# Altium schematic sheet flarm-f4-interface.SchDoc
size A4; SheetNumber: 1; SheetTotal: 1
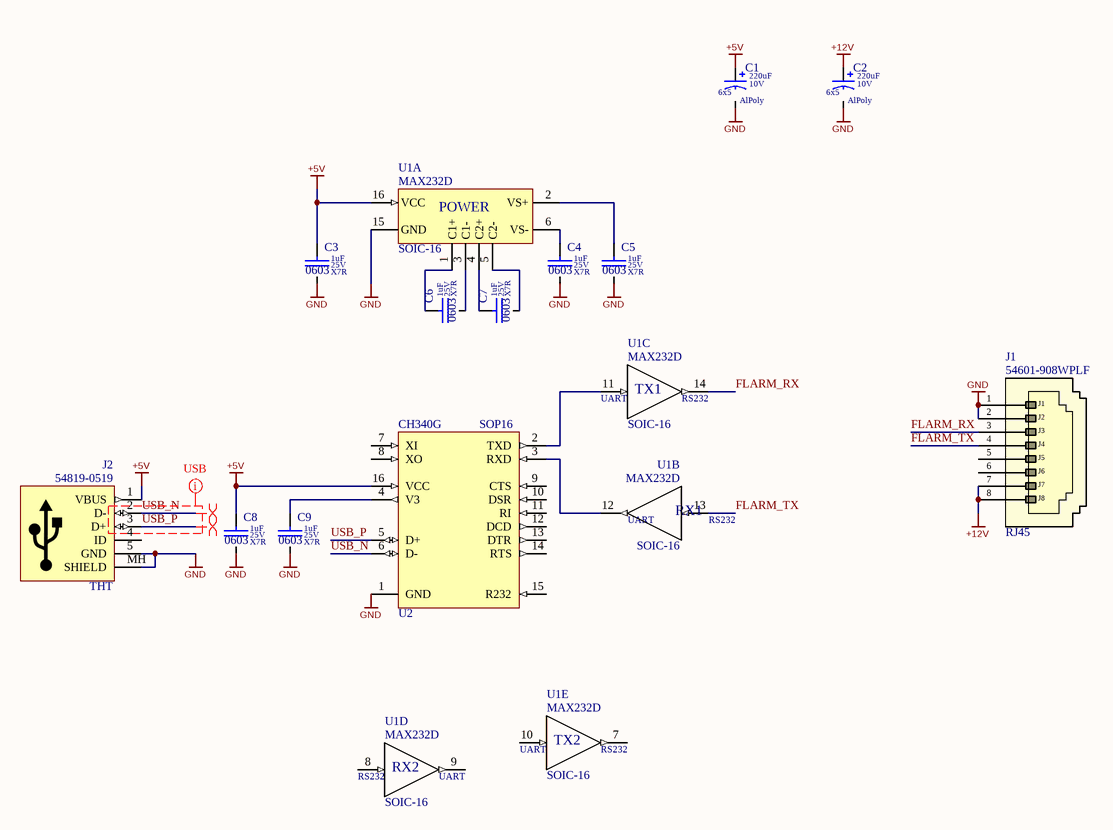
[diagram p0: flarm-f4-interface.SchDoc]

## Parts
C1  value 220uF  Dielectric: AlPoly  SCH_Footprint: 6x5  Voltage: 10V  [CE_D_6x5_SMD]  (hidden comment: Electrolytic Capacitor)
C2  value 220uF  Dielectric: AlPoly  SCH_Footprint: 6x5  Voltage: 10V  [CE_D_6x5_SMD]  (hidden comment: Electrolytic Capacitor)
C3  value 1uF  Dielectric: X7R  Voltage: 25V  SCH_Footprint: 0603  [C_0603_1608]  (hidden comment: Ceramic X7R)
C4  value 1uF  Dielectric: X7R  Voltage: 25V  SCH_Footprint: 0603  [C_0603_1608]  (hidden comment: Ceramic X7R)
C5  value 1uF  Dielectric: X7R  Voltage: 25V  SCH_Footprint: 0603  [C_0603_1608]  (hidden comment: Ceramic X7R)
C6  value 1uF  Dielectric: X7R  Voltage: 25V  SCH_Footprint: 0603  [C_0603_1608]  (hidden comment: Ceramic X7R)
C7  value 1uF  Dielectric: X7R  Voltage: 25V  SCH_Footprint: 0603  [C_0603_1608]  (hidden comment: Ceramic X7R)
C8  value 1uF  Dielectric: X7R  Voltage: 25V  SCH_Footprint: 0603  [C_0603_1608]  (hidden comment: Ceramic X7R)
C9  value 1uF  Dielectric: X7R  Voltage: 25V  SCH_Footprint: 0603  [C_0603_1608]  (hidden comment: Ceramic X7R)
J1  value 54601-908WPLF  SCH_Footprint: RJ45  [J_RJ45_54601-908WPLF]  (hidden comment: RJ45 without magnetics)
J2  value 54819-0519  SCH_Footprint: THT  [J_USB_MINIB_54819-0519_THT]  (hidden comment: USB connector)
U1  value MAX232D  SCH_Footprint: SOIC-16  [SOP16_SO16_SOIC16_4X10X6]  (hidden comment: MAX232D UART/RS-232 Converter)  (parts A,B,C,D,E of 5)
U2  value CH340G  SCH_Footprint: SOP16  [SOP16_SO16_SOIC16_4X10X6]  (hidden comment: USB to serial chip)

## Nets
+5V: C1.1 C3.1 C8.1 J2.1(VBUS) U1.16(VCC) U2.16(VCC)
+12V: C2.1 J1.7 J1.8
GND: C1.2 C2.2 C3.2 C4.2 C5.2 C8.2 C9.2 J1.1 J1.2 J2.5(GND) J2.MH(SHIELD) U1.15(GND) U2.1(GND)
FLARM_RX: J1.3 U1.14(T1OUT)
FLARM_TX: J1.4 U1.13(R1IN)
USB_N: J2.2(D-) U2.6(D-)
USB_P: J2.3(D+) U2.5(D+)
NetC4_1: C4.1 U1.6(VS-)
NetC5_1: C5.1 U1.2(VS+)
NetC6_1: C6.1 U1.1(C1+)
NetC6_2: C6.2 U1.3(C1-)
NetC7_1: C7.1 U1.4(C2+)
NetC7_2: C7.2 U1.5(C2-)
NetC9_1: C9.1 U2.4(V3)
NetU1_11: U1.11(T1IN) U2.2(TXD)
NetU1_12: U1.12(R1OUT) U2.3(RXD)

Not connected (* = marked no-connect by the designer): J1 5 6; J2 4(ID); U1 7(T2OUT) 8(R2IN) 9(R2OUT) 10(T2IN); U2 7(XI) 8(XO) 9(CTS) 10(DSR) 11(RI) 12(DCD) 13(DTR) 14(RTS) 15(R232)

## Layout directives
differential pair: USB_N, USB_P
net class USB: USB_N, USB_P

## Notes on the sheet
- (in symbol J_RJ45_54601-908WPLF) J2; J3; J4; J5; J6; J7; J8
- (in symbol U_MAX232D, part A) POWER
- (in symbol U_MAX232D, part B) RX1; UART; RS232
- (in symbol U_MAX232D, part C) TX1; UART; RS232
- (in symbol U_MAX232D, part D) RX2; RS232; UART
- (in symbol U_MAX232D, part E) TX2; UART; RS232

## Library data of the parts
C1 C2 = CE_220uF_10V_AlPoly_6x5_20: Polarized Capacitor; Manufacturer: Wurth Elektronik; Manufacturer Part Number: 875105244013; Tolerance (%): 20; Part Number: CE_220uF_10V_AlPoly_6x5_20; HelpURL: https://datasheet.octopart.com/875105244013-W%C3%BCrth-Elektronik-datasheet-37144758.pdf; Supplier 1: TME; Supplier 2: RS Components; Supplier Part Number 2: 8387471; Supplier 3: Farnell; Supplier Part Number 3: 2466651; Supplier 4: Mouser; Supplier Part Number 4: 710-875105244013; Supplier 5: Digi-Key; Supplier Part Number 5: 732-6413-1-ND; Supplier 6: LCSC
C3-C9 = C_1uF_25V_X7R_0603_10: Capacitor; Manufacturer: Samsung; Manufacturer Part Number: CL10B105KA8NNNC; Tolerance (%): 10; Part Number: C_1uF_25V_X7R_0603_10; HelpURL: http://www.tme.eu/pl/Document/4a42202b32dab16128fe107dd69598cc/samsung-chip-cap.pdf; Supplier 1: TME; Supplier Part Number 1: CL10B105KA8NNNC; Supplier 2: RS Components; Supplier 3: Farnell; Supplier 4: Mouser; Supplier 5: Digi-Key; Supplier 6: LCSC
J1 = J_RJ45_54601-908WPLF: Manufacturer: Amphenol; Part Number: J_RJ45_54601-908WPLF; HelpURL: https://cdn.amphenol-icc.com/media/wysiwyg/files/drawing/c-bmj-0051.pdf; Manufacturer Part Number: 54601-908WPLF; Supplier 1: TME; Supplier Part Number 1: 54601-908WPLF; Supplier 2: RS Components; Supplier 3: Farnell; Supplier Part Number 3: 2135981; Supplier 4: Mouser; Supplier Part Number 4: 649-54601-908WPLF; Supplier 5: Digi-Key; Supplier Part Number 5: 609-5081-ND; Supplier 6: LCSC
J2 = J_USB_MINIB_54819-0519: USB A THT Connector; Manufacturer: Molex; Part Number: J_USB_MINIB_54819-0519; HelpURL: http://www.molex.com/pdm_docs/sd/548190519_sd.pdf; Manufacturer Part Number: 54819-0519; Supplier 1: TME; Supplier Part Number 1: MX-54819-0519; Supplier 2: RS Components; Supplier Part Number 2: 5152005P; Supplier 3: Farnell; Supplier Part Number 3: 9786465; Supplier 4: Mouser; Supplier Part Number 4: 538-54819-0519; Supplier 5: Digi-Key; Supplier 6: LCSC
U1 = U_MAX232D: Manufacturer: Texas Instruments; Part Number: U_MAX232D; HelpURL: https://www.ti.com/lit/ds/symlink/max232.pdf; Manufacturer Part Number: MAX232D; Supplier 1: TME; Supplier Part Number 1: MAX232D; Supplier 2: RS Components; Supplier Part Number 2: 5172908; Supplier 3: Farnell; Supplier Part Number 3: 3006953; Supplier 4: Mouser; Supplier Part Number 4: 595-MAX232D; Supplier 5: Digi-Key; Supplier Part Number 5: 296-6936-5-ND; Supplier 6: LCSC
U2 = U_CH340G: Manufacturer: WCH; Part Number: U_CH340G; HelpURL: https://www.mpja.com/download/35227cpdata.pdf; Manufacturer Part Number: CH340G; Supplier 1: TME; Supplier 2: RS Components; Supplier 3: Farnell; Supplier 4: Mouser; Supplier 5: Digi-Key; Supplier 6: LCSC; Supplier 7: WCH; Supplier Part Number 7: CH340G